# EAGLE design untitled (EAGLE 7.5.0)
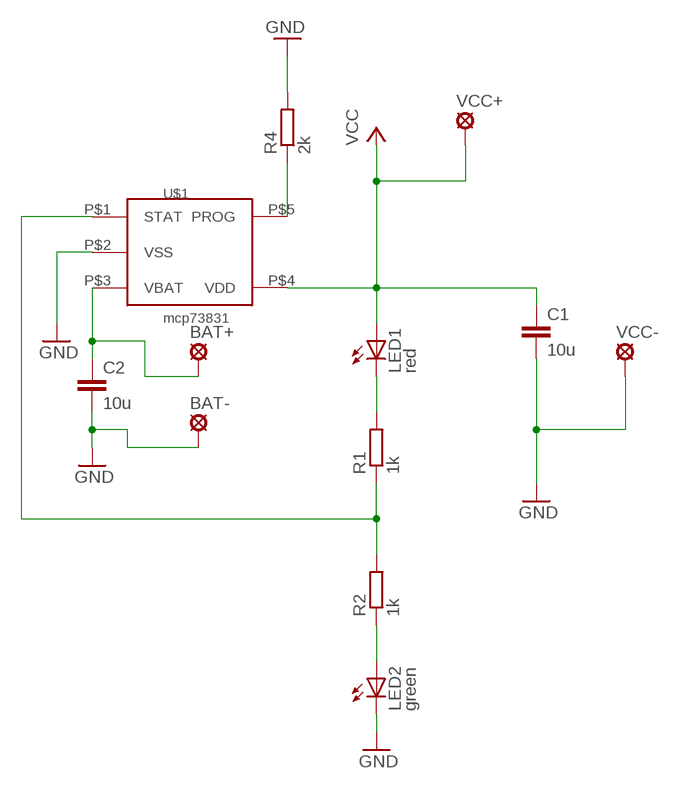
[diagram p0: schematic, sheet 1]

## Parts
BAT+  LSP10  [LSP10]
BAT-  LSP10  [LSP10]
C1  10u  C-EUC0805  [C0805]
C2  10u  C-EUC0805  [C0805]
LED1  red  LEDCHIPLED_0805  [CHIPLED_0805]
LED2  green  LEDCHIPLED_0805  [CHIPLED_0805]
R1  1k  R-EU_M1206  [M1206]
R2  1k  R-EU_M1206  [M1206]
R4  2k  R-EU_M1206  [M1206]
U$1  mcp73831  MCP73831  [5PIN_SOT23]
VCC+  LSP10  [LSP10]
VCC-  LSP10  [LSP10]

## Nets
GND: BAT-.MP C1.2 C2.2 LED2.C R4.2 U$1.P$2(VSS) VCC-.MP
N$1: R4.1 U$1.P$5(PROG)
N$2: LED1.C R1.2
N$3: R1.1 R2.2 U$1.P$1(STAT)
N$4: LED2.A R2.1
N$5: BAT+.MP C2.1 U$1.P$3(VBAT)
VCC: C1.1 LED1.A U$1.P$4(VDD) VCC+.MP

## Library data of the parts
BAT+ BAT- VCC+ VCC- = solpad:LSP10: SOLDER PAD drill 1.0 mm, distributor Buerklin, 12H555
C1 C2 = resistor:C-EU: CAPACITOR, European symbol
LED1 LED2 = led:LED: LED OSRAM: - CHIPLED LG R971, LG N971, LY N971, LG Q971, LY Q971, LO R971, LY R971 LH N974, LH R974 LS Q976, LO Q976, LY Q976 LO Q996 - Hyper CHIPLED LW Q18S LB Q993, LB Q99A, LB R99A - SideLED LS A670, LO A670, LY A670, LG A670, LP A670 LB A673, LV A673, LT A673, LW A673 LH A674 LY A675 LS A676, LA A676, LO A676, LY A676, LW A676 LS A679, LY A679, LG A679 - Hyper Micro SIDELED® LS Y876, LA Y876, LO Y876, LY Y876 LT Y87S - SmartLED LW L88C, LW L88S LB L89C, LB L89S, LG L890 LS L89K, LO L89K, LY L89K LS L896, LA L896, LO L896, LY L896 - TOPLED LS T670, LO T670, LY T670, LG T670, LP T670 LSG T670, LSP T670, LSY T670, LOP T670, LYG T670 LG T671, LOG T671, LSG T671 LB T673, LV T673, LT T673, LW T673 LH T674 LS T676, LA T676, LO T676, LY T676, LB T676, LH T676, LSB T676, LW T676 LB T67C, LV T67C, LT T67C, LS T67K, LO T67K, LY T67K, LW E67C LS E67B, LA E67B, LO E67B, LY E67B, LB E67C, LV E67C, LT E67C LW T67C LS T679, LY T679, LG T679 LS T770, LO T770, LY T770, LG T770, LP T770 LB T773, LV T773, LT T773, LW T773 LH T774 LS E675, LA E675, LY E675, LS T675 LS T776, LA T776, LO T776, LY T776, LB T776 LHGB T686 LT T68C, LB T68C - Hyper Mini TOPLED® LB M676 - Mini TOPLED Santana® LG M470 LS M47K, LO M47K, LY M47K Source: http://www.osram.convergy.de LUXEON: - LUMILED® LXK2-PW12-R00, LXK2-PW12-S00, LXK2-PW14-U00, LXK2-PW14-V00 LXK2-PM12-R00, LXK2-PM12-S00, LXK2-PM14-U00 LXK2-PE12-Q00, LXK2-PE12-R00, LXK2-PE12-S00, LXK2-PE14-T00, LXK2-PE14-U00 LXK2-PB12-K00, LXK2-PB12-L00, LXK2-PB12-M00, LXK2-PB14-N00, LXK2-PB14-P00, LXK2-PB14-Q00 LXK2-PR12-L00, LXK2-PR12-M00, LXK2-PR14-Q00, LXK2-PR14-R00 LXK2-PD12-Q00, LXK2-PD12-R00, LXK2-PD12-S00 LXK2-PH12-R00, LXK2-PH12-S00 LXK2-PL12-P00, LXK2-PL12-Q00, LXK2-PL12-R00 Source: www.luxeon.com KINGBRIGHT: KA-3528ASYC Source: www.kingbright.com
R1 R2 R4 = resistor:R-EU_: RESISTOR, European symbol
U$1 = mcp73831:MCP73831: Digikey No:- __MCP73831T-2ACI/OTCT-ND__

## Board
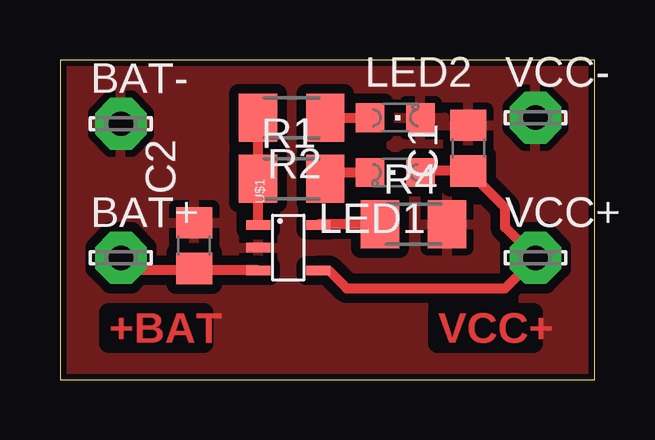
[diagram p1: board, top side]

Size 22.28 x 13.32 mm. Coordinates in mm from the lower left corner, seen from the top.
Outline: 0,0 22.28,0 22.28,13.32 0,13.32 0,0
Copper layers (1*16): Top 0.035mm / dielectric 1.5mm / Bottom 0.035mm
Design rules "default 16mils": minimum track width 10mil, minimum drill 24mil, track to track 16mil, track to pad 16mil, pad to pad 16mil, via to via 16mil, smd to smd 10mil, copper to edge 10mil, drill to drill 10mil, minimum pad ring 10mil, minimum via ring 8mil, stop-mask expansion 4mil, vias tented up to drill 0mil, thermal gap 12mil

### Footprints (pad centres in the part's own frame; a part is rotated, then mirrored left to right if it is on the bottom)
LSP10 = drill 1.016 pad 2.159 octagon: MP 0,0
C0805 = smd 1.3 x 1.5: 1 -0.95,0; 2 0.95,0
CHIPLED_0805 = smd 1.2 x 1.2: A 0,-1.05; C 0,1.05
M1206 = smd 1.6 x 2: 1 -1.4,0; 2 1.4,0
5PIN_SOT23 = smd 0.4 x 1: P$1 0.4,-0.63; P$2 1.35,-0.63; P$3 2.3,-0.63; P$4 2.3,1.87; P$5 0.4,1.87

### Placement (x,y rotation side)
BAT+  2.54,5.08 0 top
BAT-  2.54,10.67 0 top
C1  17.02,9.65 90 top
C2  5.59,5.59 90 top
LED1  13.97,8.64 90 top
LED2  13.97,10.92 270 top
R1  9.65,8.38 0 top
R2  9.65,10.92 180 top
R4  14.73,6.48 0 top
U$1  8.89,6.86 270 top
VCC+  19.81,5.08 0 top
VCC-  19.81,10.92 0 top

### Tracks (layer width: path | path; a pad name or v marks a point on that pad's centre or on a via)
GND
  pour Top: 0,13.21 22.35,13.21 22.35,0 0,0
N$1
  Top 0.406: R4.1 10.76,6.48 U$1.P$5
N$2
  Top 0.406: LED1.C 11.31,8.64 R1.2
N$3
  Top 0.406: U$1.P$1 8.25,6.46 R1.1 R2.2
N$4
  Top 0.406: R2.1 LED2.A
N$5
  Top 0.406: U$1.P$3 5.59,4.56 | 5.59,4.56 C2.1 | 5.59,4.56 3.06,4.56 BAT+.MP
VCC
  Top 0.406: LED1.A 15.02,8.7 C1.1 18.54,7.18 18.54,6.35 VCC+.MP 18.54,3.81 11.94,3.81 11.19,4.56 U$1.P$4

### Text on the board
Top: +BAT | VCC+